# EAGLE schematic block_diagram (EAGLE 9.6.2)
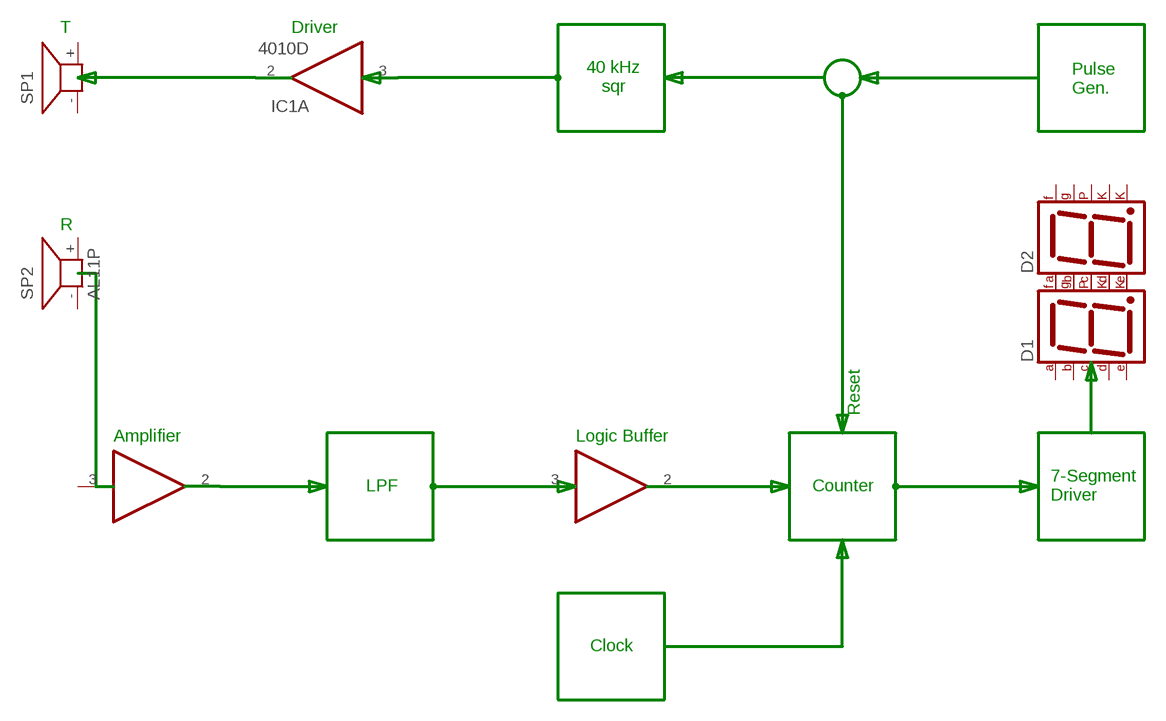
[diagram p0: schematic, sheet 1]

## Parts
D1  7SEG-MCK  [7SEG-7]
D2  7SEG-MCK  [7SEG-7]
IC1  4010D  [SO16]
IC2  4010D  [SO16]
IC3  4010D  [SO16]
SP1  AL11P  [AL11P]
SP2  AL11P  [AL11P]

## Nets
N$2: IC3.2(A:O)
N$5: IC1.2(A:O)
N$9: IC2.2(A:O)
N$15: IC1.3(A:I)
N$20: IC3.3(A:I)
N$21: D1.8(C)
Unconnected: D1.1(CK1) D1.2(F) D1.3(G) D1.4(E) D1.5(D) D1.6(CK2) D1.7(DP) D1.9(B) D1.10(A) D2.1(CK1) D2.2(F) D2.3(G) D2.4(E) D2.5(D) D2.6(CK2) D2.7(DP) D2.8(C) D2.9(B) D2.10(A) IC1.4(B:O) IC1.5(B:I) IC1.6(C:O) IC1.7(C:I) IC1.9(D:I) IC1.10(D:O) IC1.11(E:I) IC1.12(E:O) IC1.14(F:I) IC1.15(F:O) IC2.3(A:I) IC2.4(B:O) IC2.5(B:I) IC2.6(C:O) IC2.7(C:I) IC2.9(D:I) IC2.10(D:O) IC2.11(E:I) IC2.12(E:O) IC2.14(F:I) IC2.15(F:O) IC3.4(B:O) IC3.5(B:I) IC3.6(C:O) IC3.7(C:I) IC3.9(D:I) IC3.10(D:O) IC3.11(E:I) IC3.12(E:O) IC3.14(F:I) IC3.15(F:O) SP1.+ SP1.- SP2.+ SP2.-

## Notes on the sheet
- T | Driver
- 40 kHz
     sqr
- Pulse
  Gen.
- R
- Reset
- Amplifier | Logic Buffer
- LPF | Counter
- 7-Segment
  Driver
- Clock

## Power pins joined to a net without a drawn wire
VCC: IC1.1(P:VCC) IC2.1(P:VCC) IC3.1(P:VCC)
VDD: IC1.16(P:VDD) IC2.16(P:VDD) IC3.16(P:VDD)
VSS: IC1.8(P:VSS) IC2.8(P:VSS) IC3.8(P:VSS)

## Library data of the parts
D1 D2 = special:7SEG-MCK: 7-segment DISPLAY single cathode, 13 mm
IC1-IC3 = 40xx:4010: Hex BUFFER, Non-inverting Source: www.fairchildsemi.com CD4010.pdf © 2000 Fairchild Semiconductor Corporation DS005945
SP1 SP2 = buzzer:AL11P: SPEAKER Source: Buerklin; OC_FARNELL: unknown; OC_NEWARK: unknown